# Altium schematic sheet MCU.SchDoc
size A4; DocumentNumber: 5; SheetNumber: 5; SheetTotal: 8
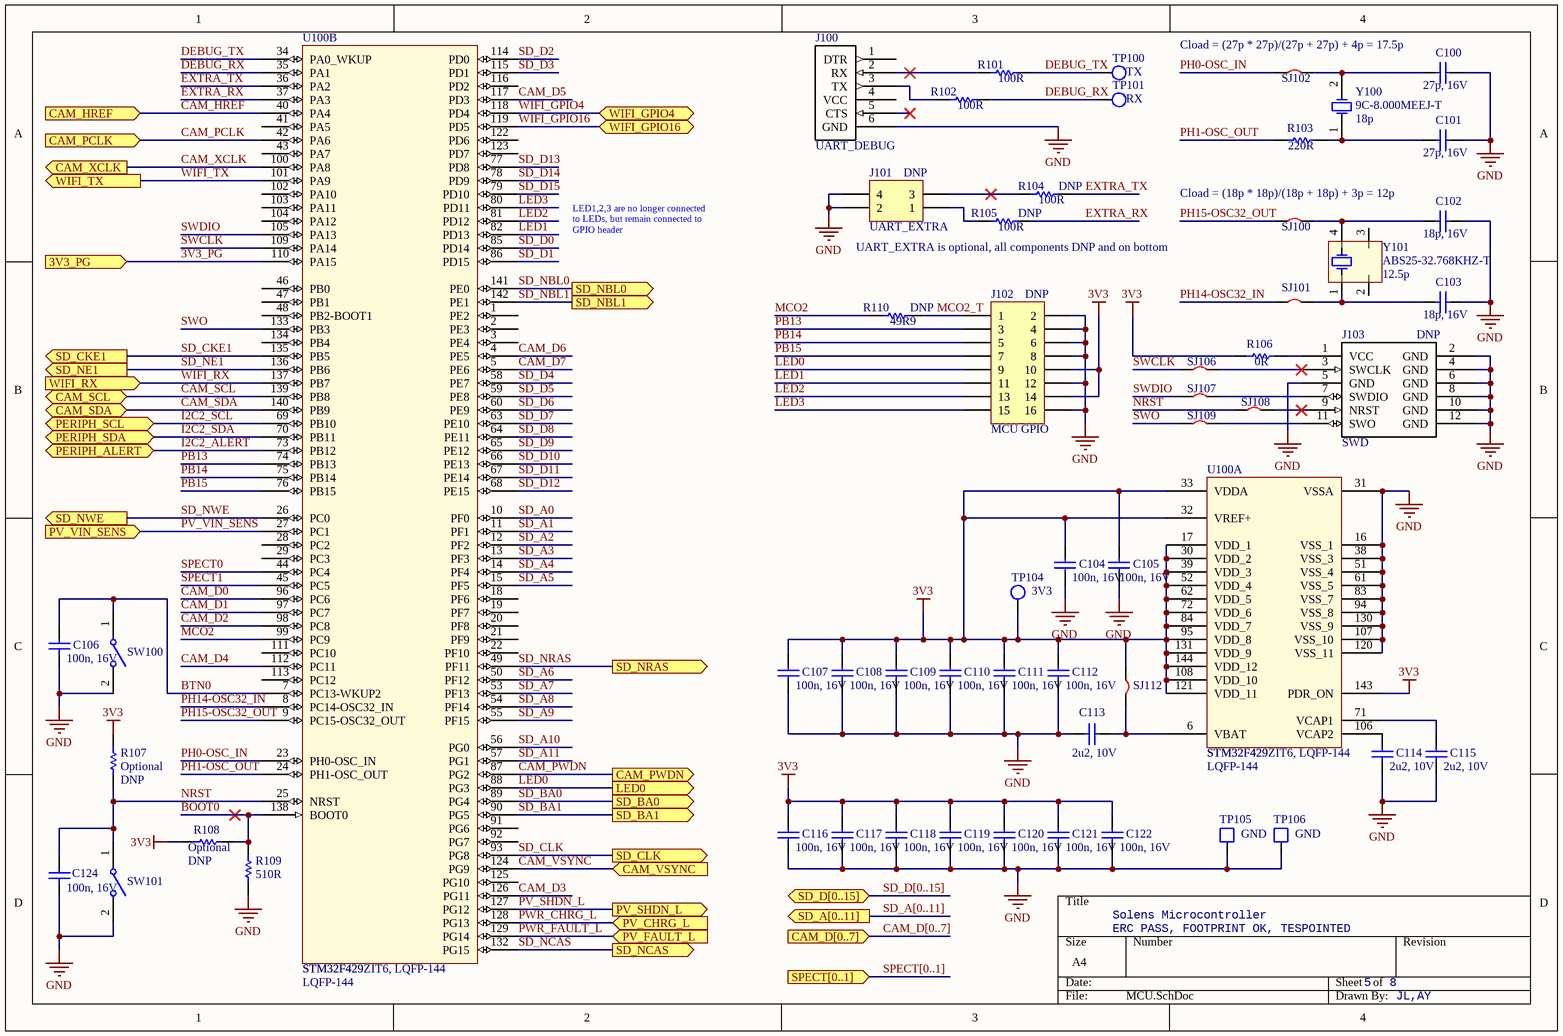
[diagram p0: MCU.SchDoc]

## Parts
C100  value 27p, 16V  [CAP_0402]  (hidden comment: 27p, 16V, 0402)
C101  value 27p, 16V  [CAP_0402]  (hidden comment: 27p, 16V, 0402)
C102  value 18p, 16V  [CAP_0402]  (hidden comment: 18p, 16V, 0402)
C103  value 18p, 16V  [CAP_0402]  (hidden comment: 18p, 16V, 0402)
C104  value 100n, 16V  [CAP_0402]  (hidden comment: 100n, 16V, 0402)
C105  value 100n, 16V  [CAP_0402]  (hidden comment: 100n, 16V, 0402)
C106  value 100n, 16V  [CAP_0402]  (hidden comment: 100n, 16V, 0402)
C107  value 100n, 16V  [CAP_0402]  (hidden comment: 100n, 16V, 0402)
C108  value 100n, 16V  [CAP_0402]  (hidden comment: 100n, 16V, 0402)
C109  value 100n, 16V  [CAP_0402]  (hidden comment: 100n, 16V, 0402)
C110  value 100n, 16V  [CAP_0402]  (hidden comment: 100n, 16V, 0402)
C111  value 100n, 16V  [CAP_0402]  (hidden comment: 100n, 16V, 0402)
C112  value 100n, 16V  [CAP_0402]  (hidden comment: 100n, 16V, 0402)
C113  value 2u2, 10V  [CAP_0805]  (hidden comment: 2u2, 10V, 0805)
C114  value 2u2, 10V  [CAP_0805]  (hidden comment: 2u2, 10V, 0805)
C115  value 2u2, 10V  [CAP_0805]  (hidden comment: 2u2, 10V, 0805)
C116  value 100n, 16V  [CAP_0402]  (hidden comment: 100n, 16V, 0402)
C117  value 100n, 16V  [CAP_0402]  (hidden comment: 100n, 16V, 0402)
C118  value 100n, 16V  [CAP_0402]  (hidden comment: 100n, 16V, 0402)
C119  value 100n, 16V  [CAP_0402]  (hidden comment: 100n, 16V, 0402)
C120  value 100n, 16V  [CAP_0402]  (hidden comment: 100n, 16V, 0402)
C121  value 100n, 16V  [CAP_0402]  (hidden comment: 100n, 16V, 0402)
C122  value 100n, 16V  [CAP_0402]  (hidden comment: 100n, 16V, 0402)
C124  value 100n, 16V  [CAP_0402]  (hidden comment: 100n, 16V, 0402)
J100  Function: UART_DEBUG  [HDR_100TH_1x6]  (hidden comment: HDR_1x6_100TH_THT)
J101  Function: UART_EXTRA  [HDR_100TH_2X2_SMT]  (hidden comment: HDR_2x2_100TH_SMT (DNP))
J102  Function: MCU GPIO  [HDR_100TH_2X8_SMT]  (hidden comment: HDR_2x8_100TH_SMT (DNP))
J103  Function: SWD  [HDR_100TH_2X6_SMT]  (hidden comment: HDR_2x8_100TH_SMT)
R101  value 100R  [RES_0805]  (hidden comment: 100R, 1/8W, 0805)
R102  value 100R  [RES_0805]  (hidden comment: 100R, 1/8W, 0805)
R103  value 220R  [RES_0805]  (hidden comment: 220R, 1/8W, 0805)
R104  value 100R  [RES_0805]  (hidden comment: 100R, 1/8W, 0805 (DNP))
R105  value 100R  [RES_0805]  (hidden comment: 100R, 1/8W, 0805 (DNP))
R106  value 0R  [RES_0805]  (hidden comment: 0R, 1/8W, 0805 (DNP))
R107  value Optional  [RES_0805]  (hidden comment: 0R, 1/8W, 0805 (DNP))
R108  value Optional  [RES_0805]  (hidden comment: 0805 (DNP))
R109  value 510R  [RES_0805]  (hidden comment: 510R, 1/8W, 0805)
R110  value 49R9  [RES_0805]  (hidden comment: 49R9, 1/8W, 0805 (DNP))
SJ100  SJ, 0805 (DNP)  [SJ_0805]  (value not drawn)
SJ101  SJ, 0805 (DNP)  [SJ_0805]  (value not drawn)
SJ102  SJ, 0805 (DNP)  [SJ_0805]  (value not drawn)
SJ106  SJ, 0805 (DNP)  [SJ_0805]  (value not drawn)
SJ107  SJ, 0805 (DNP)  [SJ_0805]  (value not drawn)
SJ108  SJ, 0805 (DNP)  [SJ_0805]  (value not drawn)
SJ109  SJ, 0805 (DNP)  [SJ_0805]  (value not drawn)
SJ112  SJ, 0805 (DNP)  [SJ_0805]  (value not drawn)
SW100  434121043816, TACT SPST NO  [4341x10438x6]  (value not drawn)
SW101  434121043816, TACT SPST NO  [4341x10438x6]  (value not drawn)
TP100  VisibleNetName: TX  [TP_SMALL]  (hidden comment: TP (DNP))
TP101  VisibleNetName: RX  [TP_SMALL]  (hidden comment: TP (DNP))
TP104  VisibleNetName: 3V3  [TP_SMALL]  (hidden comment: TP (DNP))
TP105  VisibleNetName: GND  [TP_LARGE]  (hidden comment: TP (DNP))
TP106  VisibleNetName: GND  [TP_LARGE]  (hidden comment: TP (DNP))
U100  STM32F429ZIT6, LQFP-144  PackageName: LQFP-144  [TSQFP50P2200X2200X160-144M]  (parts A,B of 2)
Y100  LoadCapacitance: 18p  [HC-49S]  (hidden comment: 9C-8.000MEEJ-T)
Y101  LoadCapacitance: 12.5p  [XTAL-SOJ-4]  (hidden comment: ABS25-32.768KHZ-T)

## Ports
3V3_PG (in), CAM_D[0..7] (in), CAM_HREF (in), CAM_PCLK (in), CAM_PWDN (out), CAM_SCL (bidir), CAM_SDA (bidir), CAM_VSYNC (in), CAM_XCLK (out), LED0 (out), PERIPH_ALERT (bidir), PERIPH_SCL (bidir), PERIPH_SDA (bidir), PV_CHRG_L (in), PV_FAULT_L (in), PV_SHDN_L (out), PV_VIN_SENS (in), SD_A[0..11] (out), SD_BA0 (out), SD_BA1 (out), SD_CKE1 (out), SD_CLK (out), SD_D[0..15] (bidir), SD_NBL0 (out), SD_NBL1 (out), SD_NCAS (out), SD_NE1 (out), SD_NRAS (out), SD_NWE (out), SPECT[0..1] (in), WIFI_GPIO4 (bidir), WIFI_GPIO16 (bidir), WIFI_RX (in), WIFI_TX (out)

## Nets
3V3: C104.1 C105.1 C107.1 C108.1 C109.1 C110.1 C111.1 C112.1 C116.1 C117.1 C118.1 C119.1 C120.1 C121.1 C122.1 J102.10 J102.14 R106.1 R107.1 R108.1 SJ112.1 TP104.1 U100.17(VDD_1) U100.30(VDD_2) U100.32(VREF+) U100.33(VDDA) U100.39(VDD_3) U100.52(VDD_4) U100.62(VDD_5) U100.72(VDD_6) U100.84(VDD_7) U100.95(VDD_8) U100.108(VDD_10) U100.121(VDD_11) U100.131(VDD_9) U100.143(PDR_ON) U100.144(VDD_12)
GND: C100.2 C101.2 C102.2 C103.2 C104.2 C105.2 C106.2 C107.2 C108.2 C109.2 C110.2 C111.2 C112.2 C113.1 C114.2 C115.2 C116.2 C117.2 C118.2 C119.2 C120.2 C121.2 C122.2 C124.2 J100.6(GND) J101.2 J101.4 J102.2 J102.4 J102.6 J102.8 J102.12 J102.16 J103.2(GND) J103.4(GND) J103.5(GND) J103.6(GND) J103.8(GND) J103.10(GND) J103.12(GND) R109.2 SW100.2 SW101.2 TP105.1 TP106.1 U100.16(VSS_1) U100.31(VSSA) U100.38(VSS_3) U100.51(VSS_4) U100.61(VSS_5) U100.83(VSS_7) U100.94(VSS_8) U100.107(VSS_10) U100.120(VSS_11) U100.130(VSS_9)
3V3_PG: U100.110(PA15) ; port 3V3_PG
BOOT0: R108.2 R109.1 U100.138(BOOT0)
BTN0: C106.1 SW100.1 U100.7(PC13-WKUP2)
CAM_D0: U100.96(PC6)
CAM_D1: U100.97(PC7)
CAM_D2: U100.98(PC8)
CAM_D3: U100.126(PG11)
CAM_D4: U100.112(PC11)
CAM_D5: U100.117(PD3)
CAM_D6: U100.4(PE5)
CAM_D7: U100.5(PE6)
CAM_HREF: U100.40(PA4) ; port CAM_HREF
CAM_PCLK: U100.42(PA6) ; port CAM_PCLK
CAM_PWDN: U100.87(PG2) ; port CAM_PWDN
CAM_SCL: U100.139(PB8) ; port CAM_SCL
CAM_SDA: U100.140(PB9) ; port CAM_SDA
CAM_VSYNC: U100.124(PG9) ; port CAM_VSYNC
CAM_XCLK: U100.100(PA8) ; port CAM_XCLK
DEBUG_RX: R102.2 TP101.1 U100.35(PA1)
DEBUG_TX: R101.2 TP100.1 U100.34(PA0_WKUP)
EXTRA_RX: R105.2 U100.37(PA3)
EXTRA_TX: R104.2 U100.36(PA2)
I2C2_ALERT: U100.73(PB12) ; port PERIPH_ALERT
I2C2_SCL: U100.69(PB10) ; port PERIPH_SCL
I2C2_SDA: U100.70(PB11) ; port PERIPH_SDA
LED0: J102.9 U100.88(PG3) ; port LED0
LED1: J102.11 U100.82(PD13)
LED2: J102.13 U100.81(PD12)
LED3: J102.15 U100.80(PD11)
MCO2: R110.1 U100.99(PC9)
MCO2_T: J102.1 R110.2
NRST: C124.1 R107.2 SJ108.1 SW101.1 U100.25(NRST)
PB13: J102.3 U100.74(PB13)
PB14: J102.5 U100.75(PB14)
PB15: J102.7 U100.76(PB15)
PH0-OSC_IN: SJ102.1 U100.23(PH0-OSC_IN)
PH1-OSC_OUT: R103.1 U100.24(PH1-OSC_OUT)
PH14-OSC32_IN: SJ101.1 U100.8(PC14-OSC32_IN)
PH15-OSC32_OUT: SJ100.1 U100.9(PC15-OSC32_OUT)
PV_SHDN_L: U100.127(PG12) ; port PV_SHDN_L
PV_VIN_SENS: U100.27(PC1) ; port PV_VIN_SENS
PWR_CHRG_L: U100.128(PG13) ; port PV_CHRG_L
PWR_FAULT_L: U100.129(PG14) ; port PV_FAULT_L
SD_A0: U100.10(PF0)
SD_A1: U100.11(PF1)
SD_A2: U100.12(PF2)
SD_A3: U100.13(PF3)
SD_A4: U100.14(PF4)
SD_A5: U100.15(PF5)
SD_A6: U100.50(PF12)
SD_A7: U100.53(PF13)
SD_A8: U100.54(PF14)
SD_A9: U100.55(PF15)
SD_A10: U100.56(PG0)
SD_A11: U100.57(PG1)
SD_BA0: U100.89(PG4) ; port SD_BA0
SD_BA1: U100.90(PG5) ; port SD_BA1
SD_CKE1: U100.135(PB5) ; port SD_CKE1
SD_CLK: U100.93(PG8) ; port SD_CLK
SD_D0: U100.85(PD14)
SD_D1: U100.86(PD15)
SD_D2: U100.114(PD0)
SD_D3: U100.115(PD1)
SD_D4: U100.58(PE7)
SD_D5: U100.59(PE8)
SD_D6: U100.60(PE9)
SD_D7: U100.63(PE10)
SD_D8: U100.64(PE11)
SD_D9: U100.65(PE12)
SD_D10: U100.66(PE13)
SD_D11: U100.67(PE14)
SD_D12: U100.68(PE15)
SD_D13: U100.77(PD8)
SD_D14: U100.78(PD9)
SD_D15: U100.79(PD10)
SD_NBL0: U100.141(PE0) ; port SD_NBL0
SD_NBL1: U100.142(PE1) ; port SD_NBL1
SD_NCAS: U100.132(PG15) ; port SD_NCAS
SD_NE1: U100.136(PB6) ; port SD_NE1
SD_NRAS: U100.49(PF11) ; port SD_NRAS
SD_NWE: U100.26(PC0) ; port SD_NWE
SPECT0: U100.44(PC4)
SPECT1: U100.45(PC5)
SWCLK: SJ106.1 U100.109(PA14)
SWDIO: SJ107.1 U100.105(PA13)
SWO: SJ109.1 U100.133(PB3)
WIFI_GPIO4: U100.118(PD4) ; port WIFI_GPIO4
WIFI_GPIO16: U100.119(PD5) ; port WIFI_GPIO16
WIFI_RX: U100.137(PB7) ; port WIFI_RX
WIFI_TX: U100.101(PA9) ; port WIFI_TX
NetC100_1: C100.1 SJ102.2 Y100.2(OSC2)
NetC101_1: C101.1 R103.2 Y100.1(OSC1)
NetC102_1: C102.1 SJ100.2 Y101.4
NetC103_1: C103.1 SJ101.2 Y101.1
NetC113_2: C113.2 SJ112.2 U100.6(VBAT)
NetC114_1: C114.1 U100.106(VCAP2)
NetC115_1: C115.1 U100.71(VCAP1)
NetJ100_2: J100.2(RX) R101.1
NetJ100_3: J100.3(TX) R102.1
NetJ101_1: J101.1 R105.1
NetJ101_3: J101.3 R104.1
NetJ103_1: J103.1(VCC) R106.2
NetJ103_3: J103.3(SWCLK) SJ106.2
NetJ103_7: J103.7(SWDIO) SJ107.2
NetJ103_9: J103.9(NRST) SJ108.2
NetJ103_11: J103.11(SWO) SJ109.2

Not connected (* = marked no-connect by the designer): J100 1(DTR) 4(VCC) 5(CTS)*; U100 1(PE2) 2(PE3) 3(PE4) 18(PF6) 19(PF7) 20(PF8) 21(PF9) 22(PF10) 28(PC2) 29(PC3) 41(PA5) 43(PA7) 46(PB0) 47(PB1) 48(PB2-BOOT1) 91(PG6) 92(PG7) 102(PA10) 103(PA11) 104(PA12) 111(PC10) 113(PC12) 116(PD2) 122(PD6) 123(PD7) 125(PG10) 134(PB4); Y101 2 3

## Buses and harness runs
bus CAM_D[0..7] = port CAM_D[0..7]
bus SD_A[0..11] = port SD_A[0..11]
bus SD_D[0..15] = port SD_D[0..15]
bus SPECT[0..1] = port SPECT[0..1]

## Notes on the sheet
- Cload = (27p * 27p)/(27p + 27p) + 4p = 17.5p
- LED1,2,3 are no longer connected
  to LEDs, but remain connected to
  GPIO header
- UART_EXTRA is optional, all components DNP and on bottom
- Cload = (18p * 18p)/(18p + 18p) + 3p = 12p
- Solens Microcontroller
- ERC PASS, FOOTPRINT OK, TESPOINTED
- JL,AY

## Library data of the parts
C100-C122 C124 = Cap: Capacitor
  C100 C101: DigikeyPN: 1276-1153-1-ND
  C102 C103: DigikeyPN: 490-6203-1-ND
  C104-C112 C116-C122 C124: DigikeyPN: 587-3498-1-ND
  C113-C115: DigikeyPN: 1276-6458-1-ND
J100 = HDR_FTDI: Sparkfun FTDI pinout connector; DigikeyPN: 609-3263-ND; Value: HDR_1x6_100TH_THT
J101 = Header 2X2: Header, 2-Pin, Dual row; DNP: DNP; DigikeyPN: WM9514-ND; Value: HDR_2x2_100TH_SMT
J102 = Header 8X2: Header, 8-Pin, Dual row; DigikeyPN: WM17454-ND; DNP: DNP; Value: HDR_2x8_100TH_SMT
J103 = HDR_SWD_2x6: 6 pin SWD connector with +6 GND pins; DigikeyPN: WM17452-ND; Value: HDR_2x8_100TH_SMT
R101-R110 = Res1: Resistor
  R101 R102: DigikeyPN: 311-100CRCT-ND
  R103: DigikeyPN: 311-220CRCT-ND
  R104 R105: DigikeyPN: 311-100CRCT-ND; DNP: DNP
  R106 R107: DNP: DNP; DigikeyPN: 311-0.0CRCT-ND
  R108: DNP: DNP
  R109: DigikeyPN: 311-510CRCT-ND
  R110: DigikeyPN: 311-49.9CRCT-ND; DNP: DNP
SJ100-SJ102 SJ106-SJ109 SJ112 = SJ: Solder jumper; Value: SJ_0805 (DNP); DNP: DNP
SW100 = WS-TASV, 434121043816: WS-TASV 6.0x3.5 mm SMD; Manufacturer: Wurth Elektronik; Function: MCU BTN0; PartNumber: 434121043816; ComponentLink1URL: http://www.we-online.de; Created by: Baojun Chen; Created Date: Dec.2015; ComponentLink2URL: http://katalog.we-online.de/em/datasheet/4341x1xxx8x6.pdf; DigikeyPN: 732-7046-1-ND; Value: 434121043816
SW101 = WS-TASV, 434121043816: WS-TASV 6.0x3.5 mm SMD; Manufacturer: Wurth Elektronik; Function: MCU RESET; PartNumber: 434121043816; ComponentLink1URL: http://www.we-online.de; Created by: Baojun Chen; Created Date: Dec.2015; ComponentLink2URL: http://katalog.we-online.de/em/datasheet/4341x1xxx8x6.pdf; DigikeyPN: 732-7046-1-ND; Value: 434121043816
TP100 TP101 TP104 = TP_SMALL: Value: TP_SMALL (DNP); DigikeyPN: 36-5015CT-ND; DNP: DNP
TP105 TP106 = TP_LARGE: Value: TP_LARGE (DNP); DigikeyPN: 36-5016CT-ND; DNP: DNP
U100 = STM32F429: Cortex-M4 microcontroller; PartNumber: STM32F429
Y100 = XTAL: Crystal Oscillator; Value: 8M000; PartNumber: 9C-8.000MEEJ-T; PackageName: HC-49S; DigikeyPN: 887-1263-1-ND
Y101 = XTAL-SOJ-4: Value: 32k768; PartNumber: ABS25-32.768KHZ-T; PackageName: SOJ-4; DigikeyPN: 535-9166-1-ND